# Altium schematic sheet expansion_gpio.SchDoc
size A4
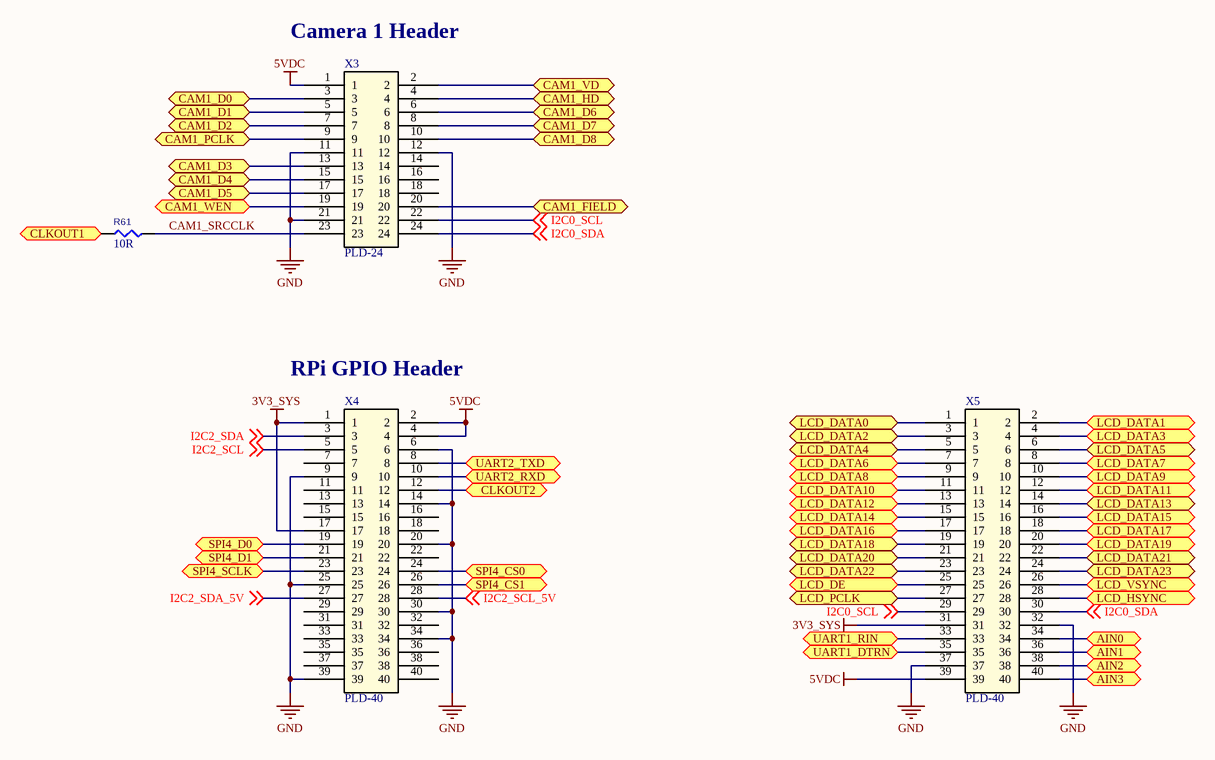
[diagram p0: expansion_gpio.SchDoc]

## Parts
R61  value 10R  [RESC1608X55N]  (hidden comment: R0603)
X3  PLD-24  [PLD-24]
X4  PLD-40  [PLD-40]
X5  PLD-40  [PLD-40]

## Ports
AIN0, AIN1, AIN2, AIN3, CAM1_D0, CAM1_D1, CAM1_D2, CAM1_D3, CAM1_D4, CAM1_D5, CAM1_D6, CAM1_D7, CAM1_D8, CAM1_FIELD, CAM1_HD, CAM1_PCLK, CAM1_VD, CAM1_WEN, CLKOUT1, CLKOUT2, LCD_DATA0, LCD_DATA1, LCD_DATA2, LCD_DATA3, LCD_DATA4, LCD_DATA5, LCD_DATA6, LCD_DATA7, LCD_DATA8, LCD_DATA9, LCD_DATA10, LCD_DATA11, LCD_DATA12, LCD_DATA13, LCD_DATA14, LCD_DATA15, LCD_DATA16, LCD_DATA17, LCD_DATA18, LCD_DATA19, LCD_DATA20, LCD_DATA21, LCD_DATA22, LCD_DATA23, LCD_DE, LCD_HSYNC, LCD_PCLK, LCD_VSYNC, SPI4_CS0, SPI4_CS1, SPI4_D0, SPI4_D1, SPI4_SCLK, UART1_DTRN, UART1_RIN, UART2_RXD, UART2_TXD

## Nets
3V3_SYS: X4.1 X4.17 X5.31
5VDC: X3.1 X4.2 X4.4 X5.39
GND: X3.11 X3.12 X3.21 X4.6 X4.9 X4.14 X4.20 X4.25 X4.30 X4.34 X4.39 X5.32 X5.37
AIN0: X5.34 ; port AIN0
AIN1: X5.36 ; port AIN1
AIN2: X5.38 ; port AIN2
AIN3: X5.40 ; port AIN3
CAM1_D0: X3.3 ; port CAM1_D0
CAM1_D1: X3.5 ; port CAM1_D1
CAM1_D2: X3.7 ; port CAM1_D2
CAM1_D3: X3.13 ; port CAM1_D3
CAM1_D4: X3.15 ; port CAM1_D4
CAM1_D5: X3.17 ; port CAM1_D5
CAM1_D6: X3.6 ; port CAM1_D6
CAM1_D7: X3.8 ; port CAM1_D7
CAM1_D8: X3.10 ; port CAM1_D8
CAM1_FIELD: X3.20 ; port CAM1_FIELD
CAM1_HD: X3.4 ; port CAM1_HD
CAM1_PCLK: X3.9 ; port CAM1_PCLK
CAM1_SRCCLK: R61.2 X3.23
CAM1_VD: X3.2 ; port CAM1_VD
CAM1_WEN: X3.19 ; port CAM1_WEN
CLKOUT1: R61.1 ; port CLKOUT1
CLKOUT2: X4.12 ; port CLKOUT2
I2C0_SCL: X3.22 X5.29 ; off-sheet I2C0_SCL
I2C0_SDA: X3.24 X5.30 ; off-sheet I2C0_SDA
I2C2_SCL: X4.5 ; off-sheet I2C2_SCL
I2C2_SCL_5V: X4.28 ; off-sheet I2C2_SCL_5V
I2C2_SDA: X4.3 ; off-sheet I2C2_SDA
I2C2_SDA_5V: X4.27 ; off-sheet I2C2_SDA_5V
LCD_DATA0: X5.1 ; port LCD_DATA0
LCD_DATA1: X5.2 ; port LCD_DATA1
LCD_DATA2: X5.3 ; port LCD_DATA2
LCD_DATA3: X5.4 ; port LCD_DATA3
LCD_DATA4: X5.5 ; port LCD_DATA4
LCD_DATA5: X5.6 ; port LCD_DATA5
LCD_DATA6: X5.7 ; port LCD_DATA6
LCD_DATA7: X5.8 ; port LCD_DATA7
LCD_DATA8: X5.9 ; port LCD_DATA8
LCD_DATA9: X5.10 ; port LCD_DATA9
LCD_DATA10: X5.11 ; port LCD_DATA10
LCD_DATA11: X5.12 ; port LCD_DATA11
LCD_DATA12: X5.13 ; port LCD_DATA12
LCD_DATA13: X5.14 ; port LCD_DATA13
LCD_DATA14: X5.15 ; port LCD_DATA14
LCD_DATA15: X5.16 ; port LCD_DATA15
LCD_DATA16: X5.17 ; port LCD_DATA16
LCD_DATA17: X5.18 ; port LCD_DATA17
LCD_DATA18: X5.19 ; port LCD_DATA18
LCD_DATA19: X5.20 ; port LCD_DATA19
LCD_DATA20: X5.21 ; port LCD_DATA20
LCD_DATA21: X5.22 ; port LCD_DATA21
LCD_DATA22: X5.23 ; port LCD_DATA22
LCD_DATA23: X5.24 ; port LCD_DATA23
LCD_DE: X5.25 ; port LCD_DE
LCD_HSYNC: X5.28 ; port LCD_HSYNC
LCD_PCLK: X5.27 ; port LCD_PCLK
LCD_VSYNC: X5.26 ; port LCD_VSYNC
SPI4_CS0: X4.24 ; port SPI4_CS0
SPI4_CS1: X4.26 ; port SPI4_CS1
SPI4_D0: X4.19 ; port SPI4_D0
SPI4_D1: X4.21 ; port SPI4_D1
SPI4_SCLK: X4.23 ; port SPI4_SCLK
UART1_DTRN: X5.35 ; port UART1_DTRN
UART1_RIN: X5.33 ; port UART1_RIN
UART2_RXD: X4.10 ; port UART2_RXD
UART2_TXD: X4.8 ; port UART2_TXD

Not connected (* = marked no-connect by the designer): X3 14 16 18; X4 7 11 13 15 16 18 22 29 31 32 33 35 36 37 38 40

## Notes on the sheet
- (near X3) Camera 1 Header
- (near X4) RPi GPIO Header

## Library data of the parts
X3 = HDR12x2: P/N: PLD-24
X4 X5 = HDR20x2: P/N: PLD-40
R61 = R0603: P/N: *